# Altium schematic sheet 02 BLOCK DIAGRAM.SchDoc
size A2; VersionControl_RevNumber: DNP; IsUserConfigurable: DNP; OrgAddr3: Sunrise FL 33323; OrgName: Pixels on Target; Page Create Date: March  8, 1995; Page Number: 5; Page Size: A2; Page Count: 14; OrgAddr2: Suite #104; RevCode: A; Doc: SCH30-00070-00; DsnPath: C:\Users\Carter Nichols\Documents\BitBucket boards (Cadence)\30-00070-00_Original\SCH30-00070-00.DSN; SchematicName: SC30-00070-00; PageName: 05-POWER IN; PageSize: A2; TopSchematic: True; Address4: United States
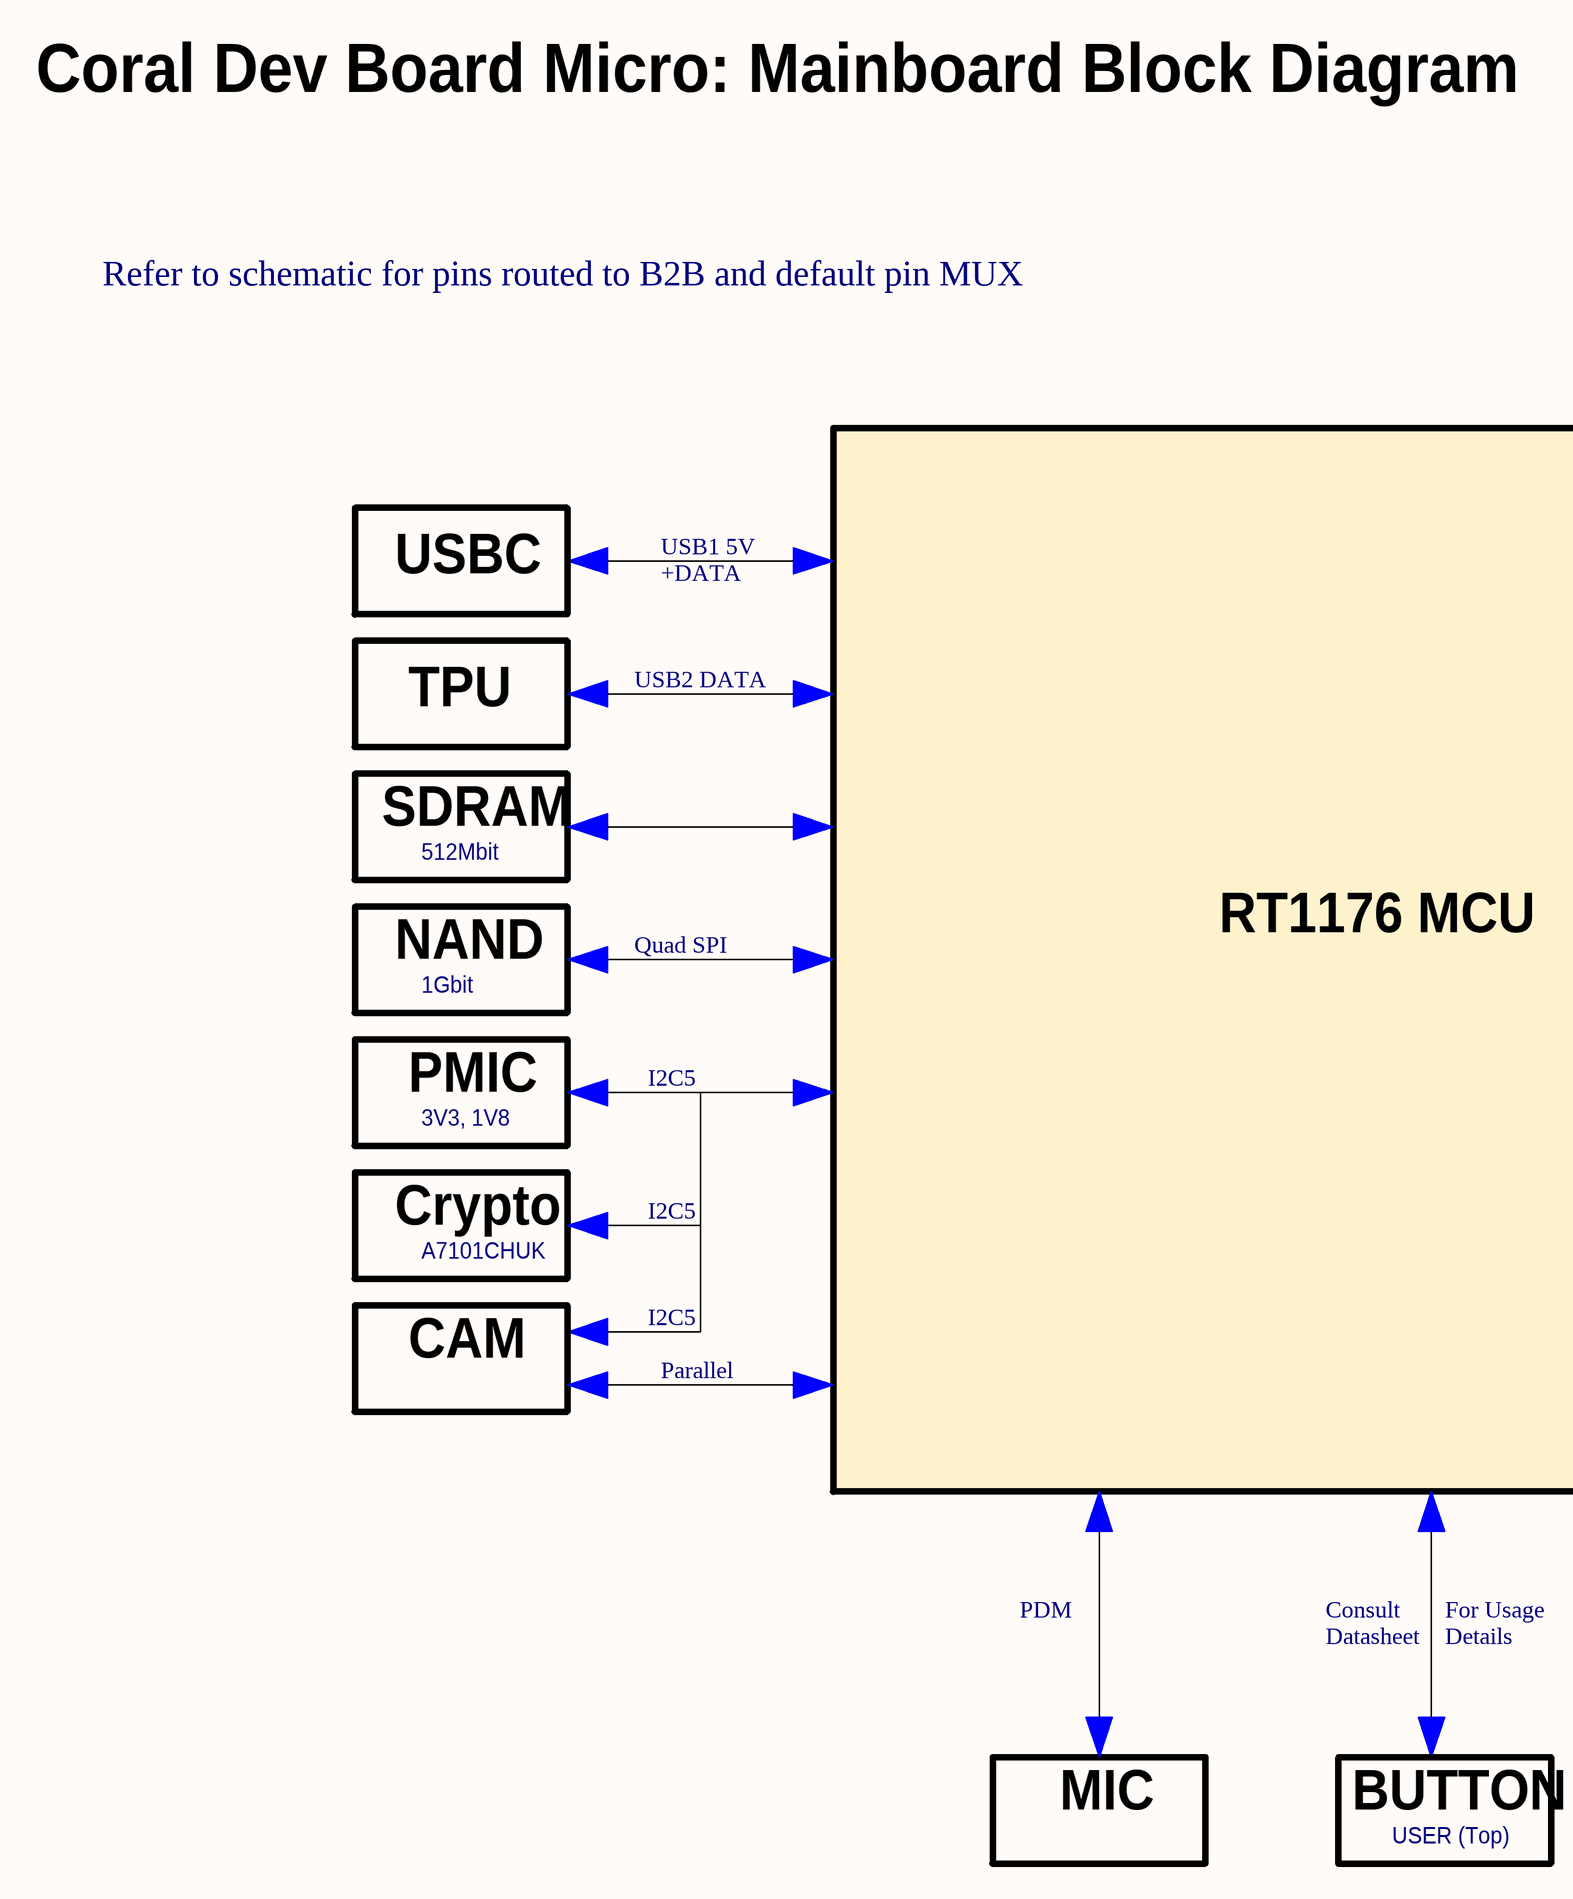
[diagram p0: 02 BLOCK DIAGRAM.SchDoc, left]
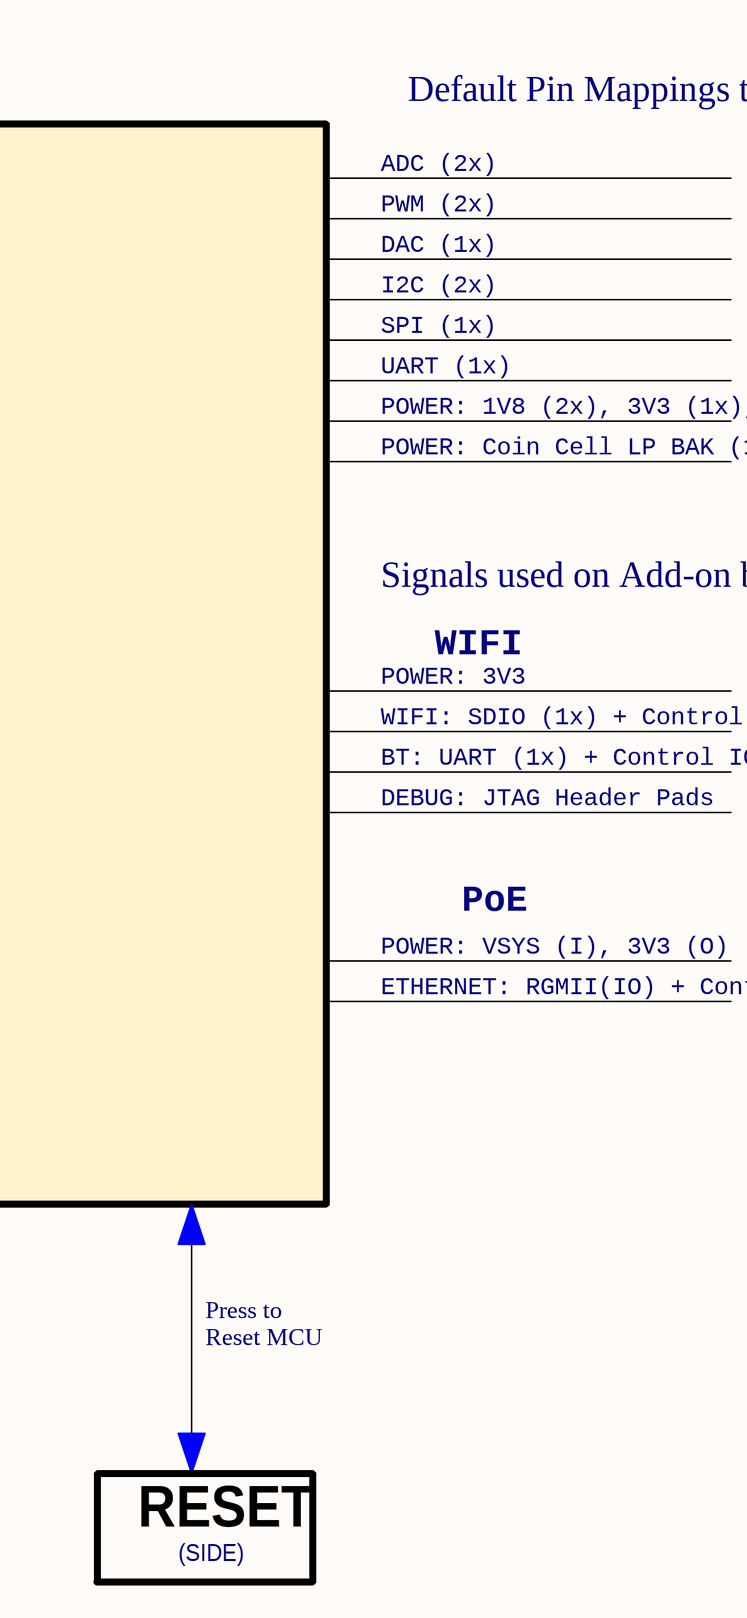
[diagram p1: 02 BLOCK DIAGRAM.SchDoc, right]

## Notes on the sheet
- Coral Dev Board Micro: Mainboard Block Diagram
- Refer to schematic for pins routed to B2B and default pin MUX
- Default Pin Mappings to Header
- ADC (2x)
- PWM (2x)
- USBC
- USB1 5V
- +DATA
- DAC (1x)
- I2C (2x)
- SPI (1x)
- TPU
- USB2 DATA
- UART (1x)
- POWER: 1V8 (2x), 3V3 (1x), VSYS 5V (1x)
- POWER: Coin Cell LP BAK (1x)
- SDRAM
- 512Mbit
- Signals used on Add-on boards at Release Time
- NAND
- Quad SPI
- RT1176 MCU
- POWER: 3V3
- WIFI
- 1Gbit
- WIFI: SDIO (1x) + Control IO
- PMIC
- I2C5
- BT: UART (1x) + Control IO
- DEBUG: JTAG Header Pads
- 3V3, 1V8
- Crypto
- POWER: VSYS (I), 3V3 (O)
- PoE
- A7101CHUK
- ETHERNET: RGMII(IO) + Control IO
- CAM
- Parallel
- PDM
- Consult
- Datasheet
- For Usage
- Details
- Press to
- Reset MCU
- MIC
- BUTTON
- USER (Top)
- RESET
- (SIDE)
- Title
- Size:
- Date:
- File:
- A2
- Number:
- Time:
- Revision:
- Sheet
- of